# Altium schematic sheet IOb.SchDoc
size A4; SheetNumber: 9; SheetTotal: 9
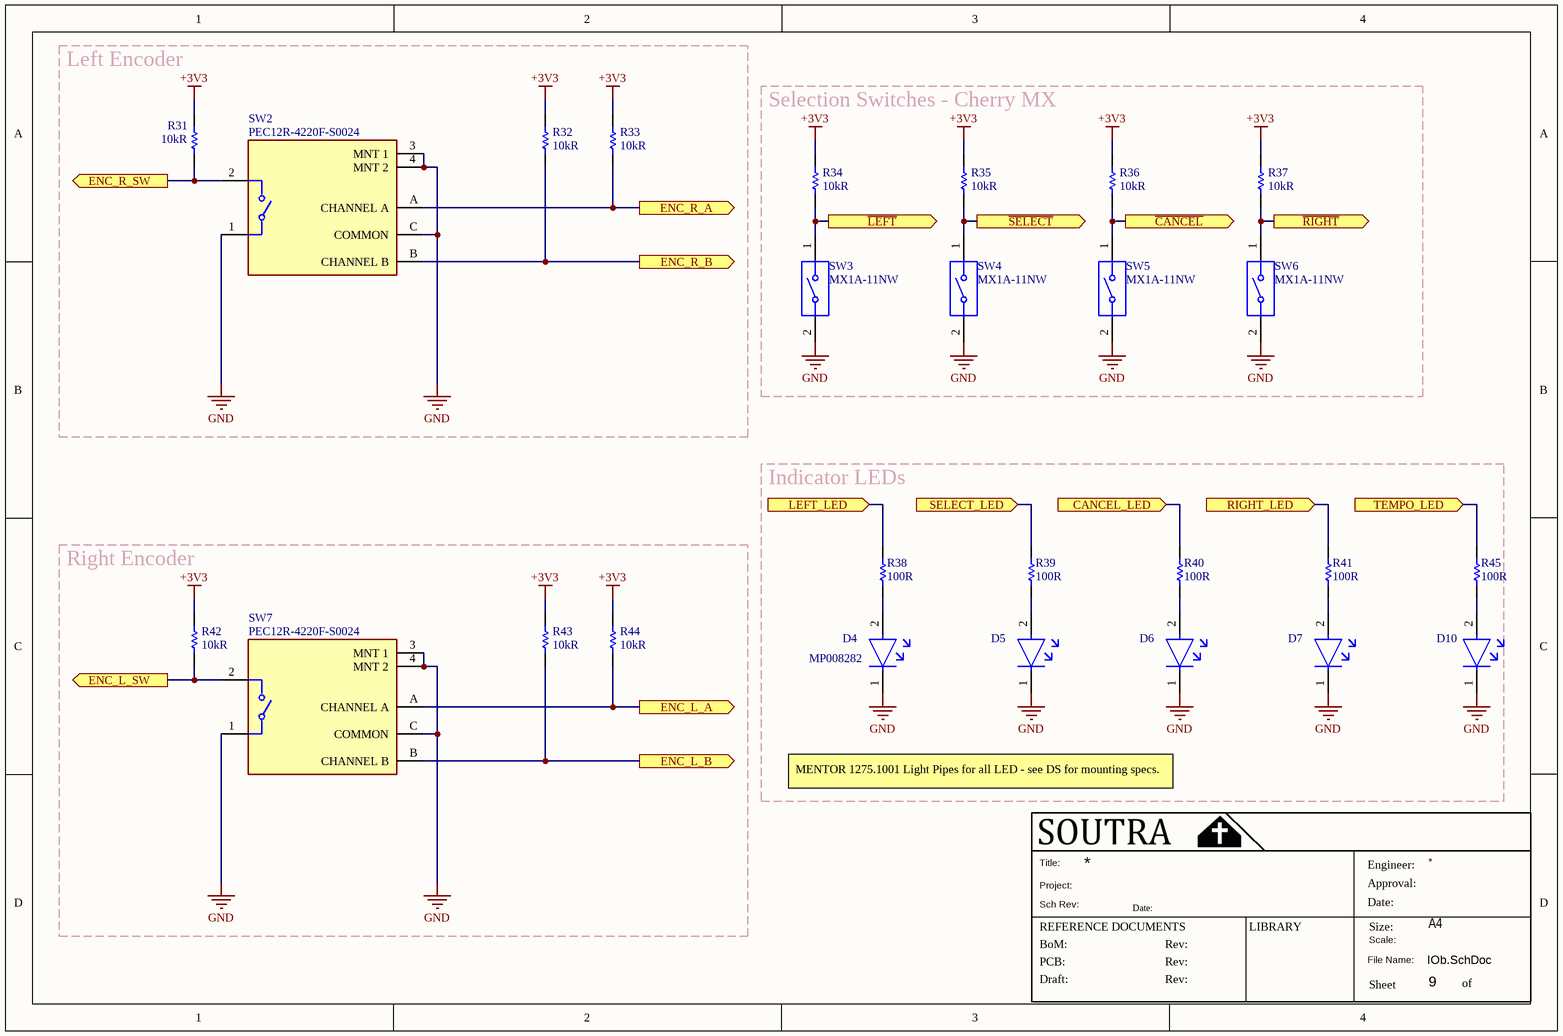
[diagram p0: IOb.SchDoc]

## Parts
D4  MP008282  [DIOC_0603_1706X06L]
D5  MP008282  [DIOC_0603_1706X06L]  (value not drawn)
D6  MP008282  [DIOC_0603_1706X06L]  (value not drawn)
D7  MP008282  [DIOC_0603_1706X06L]  (value not drawn)
D10  MP008282  [DIOC_0603_1706X06L]  (value not drawn)
R31  value 10kR  [RESC_0805_2013X50X30LL20T20]  (hidden comment: RC0805JR-0710KL)
R32  value 10kR  [RESC_0805_2013X50X30LL20T20]  (hidden comment: RC0805JR-0710KL)
R33  value 10kR  [RESC_0805_2013X50X30LL20T20]  (hidden comment: RC0805JR-0710KL)
R34  value 10kR  [RESC_0805_2013X50X30LL20T20]  (hidden comment: RC0805JR-0710KL)
R35  value 10kR  [RESC_0805_2013X50X30LL20T20]  (hidden comment: RC0805JR-0710KL)
R36  value 10kR  [RESC_0805_2013X50X30LL20T20]  (hidden comment: RC0805JR-0710KL)
R37  value 10kR  [RESC_0805_2013X50X30LL20T20]  (hidden comment: RC0805JR-0710KL)
R38  value 100R  [RESC_0805_2013X50X30LL20T20]  (hidden comment: CRCW0805100RFKTA)
R39  value 100R  [RESC_0805_2013X50X30LL20T20]  (hidden comment: CRCW0805100RFKTA)
R40  value 100R  [RESC_0805_2013X50X30LL20T20]  (hidden comment: CRCW0805100RFKTA)
R41  value 100R  [RESC_0805_2013X50X30LL20T20]  (hidden comment: CRCW0805100RFKTA)
R42  value 10kR  [RESC_0805_2013X50X30LL20T20]  (hidden comment: RC0805JR-0710KL)
R43  value 10kR  [RESC_0805_2013X50X30LL20T20]  (hidden comment: RC0805JR-0710KL)
R44  value 10kR  [RESC_0805_2013X50X30LL20T20]  (hidden comment: RC0805JR-0710KL)
R45  value 100R  [RESC_0805_2013X50X30LL20T20]  (hidden comment: CRCW0805100RFKTA)
SW2  PEC12R-4220F-S0024  [BOURNS_PEC12R-4220F-S0024]
SW3  MX1A-11NW  [CHERRY_MX1A-11NW]
SW4  MX1A-11NW  [CHERRY_MX1A-11NW]
SW5  MX1A-11NW  [CHERRY_MX1A-11NW]
SW6  MX1A-11NW  [CHERRY_MX1A-11NW]
SW7  PEC12R-4220F-S0024  [BOURNS_PEC12R-4220F-S0024]

## Blocks framed on the sheet
Left Encoder: R31-R33 SW2
Selection Switches - Cherry MX: R34-R37 SW3-SW6
Indicator LEDs: D4-D7 D10 R38-R41 R45
Right Encoder: R42-R44 SW7

## Ports
CANCEL_LED (in, see Block Diagram[2C], MCU[3B]), ENC_L_A (out, see Block Diagram[2C], MCU[2B]), ENC_L_B (out, see Block Diagram[2C], MCU[2B]), ENC_L_SW (out, see Block Diagram[2C], MCU[2B]), ENC_R_A (out, see Block Diagram[2C], MCU[3B]), ENC_R_B (out, see Block Diagram[2C], MCU[2B]), ENC_R_SW (out, see Block Diagram[2C], MCU[3B]), LEFT_LED (in, see Block Diagram[2C], MCU[2C]), RIGHT_LED (in, see Block Diagram[2C], MCU[2B]), SELECT_LED (in, see Block Diagram[2C], MCU[2C]), TEMPO_LED (in, see Block Diagram[2B], MCU[2C]), ~{CANCEL} (out, see Block Diagram[2C], MCU[3B]), ~{LEFT} (out, see Block Diagram[2B], MCU[3B]), ~{RIGHT} (out, see Block Diagram[2C], MCU[3B]), ~{SELECT} (out, see Block Diagram[2B], MCU[3B])

## Nets
+3V3: R31.2 R32.2 R33.2 R34.2 R35.2 R36.2 R37.2 R42.2 R43.2 R44.2
GND: D4.1(C) D5.1(C) D6.1(C) D7.1(C) D10.1(C) SW2.1 SW2.3(MNT_1) SW2.4(MNT_2) SW2.C(COMMON) SW3.2 SW4.2 SW5.2 SW6.2 SW7.1 SW7.3(MNT_1) SW7.4(MNT_2) SW7.C(COMMON)
~{CANCEL}: R36.1 SW5.1 ; port ~{CANCEL}
~{LEFT}: R34.1 SW3.1 ; port ~{LEFT}
~{RIGHT}: R37.1 SW6.1 ; port ~{RIGHT}
~{SELECT}: R35.1 SW4.1 ; port ~{SELECT}
CANCEL_LED: R40.1 ; port CANCEL_LED
ENC_L_A: R44.1 SW7.A(CHANNEL_A) ; port ENC_L_A
ENC_L_B: R43.1 SW7.B(CHANNEL_B) ; port ENC_L_B
ENC_L_SW: R42.1 SW7.2 ; port ENC_L_SW
ENC_R_A: R33.1 SW2.A(CHANNEL_A) ; port ENC_R_A
ENC_R_B: R32.1 SW2.B(CHANNEL_B) ; port ENC_R_B
ENC_R_SW: R31.1 SW2.2 ; port ENC_R_SW
LEFT_LED: R38.1 ; port LEFT_LED
RIGHT_LED: R41.1 ; port RIGHT_LED
SELECT_LED: R39.1 ; port SELECT_LED
TEMPO_LED: R45.1 ; port TEMPO_LED
NetD4_2: D4.2(A) R38.2
NetD5_2: D5.2(A) R39.2
NetD6_2: D6.2(A) R40.2
NetD7_2: D7.2(A) R41.2
NetD10_2: D10.2(A) R45.2

## Notes on the sheet
- MENTOR 1275.1001 Light Pipes for all LED - see DS for mounting specs.
- Title:
- Project:
- Sch Rev:
- Date:
- Engineer:
- Approval:
- REFERENCE DOCUMENTS
- BoM:
- PCB:
- Draft:
- Rev:
- LIBRARY
- File Name:
- Scale:
- Size:
- Sheet
- A4
- of

## Library data of the parts
D4-D7 D10 = MP008282: Led, Green, 70Mcd, 575Nm, 0603 Rohs Compliant: Yes; Manufacturer: Multicomp; Alternative Part: LG Q396-PS-35; Alternative Part Manufacturer: AMS OSRAM GROUP; Supplier: Farnell; Supplier Part Number: 3796313; Manufacturer Part Number: MP008282; RoHS: No; Category: Uncategorized; Stock: 8324; Pricing: 5=0.0713, 10=0.0611, 100=0.0476; Alternative Part Supplier: Farnell; Alternative Part Supplier Part Number: 2575345
R31-R37 R42-R44 = RC0805JR-0710KL: Fixed Resistor, Metal Glaze/thick Film, 0.125W, 10000ohm, 150V, 5% +/-Tol, 100ppm/Cel, Surface Mount, 0805; Manufacturer: Yageo; Alternative Part: MCMR08X103 JTL; Additional Feature: LASER TRIMMABLE; Power: 125mW; Rated Temperature: 70°C; Temperature Coefficient: 100ppm/°C; Package Height: 0.5mm; Package Length: 2mm; Package Width: 1.25mm; Supplier: Farnell; Supplier Part Number: 9234136; Manufacturer Part Number: RC0805JR-0710KL; RoHS: Yes; Category: Chip SMD Resistors; Stock: 893694; Pricing: 10=0.013, 100=0.007, 500=0.006; Mounting Technology: Surface Mount; Pins: 2; Package Shape: Rectangular; Case/Package: 0805; Terminal Finish: Nickel; Min Operating Temperature: -55°C; Max Operating Temperature: 155°C; Tolerance: 5%; JESD-609 Code: e3; Resistor Type: FIXED RESISTOR; Construction: Chip; Package Style: SMTMeter; Packaging: Tape and Reel; Technology: METAL GLAZE/THICK FILM; Termination: Wraparound; Working Voltage: 150V; Reach SVHC Compliant: Yes; RoHS Compliant: Yes; ComponentLink1URL: https://datasheet.ciiva.com:443/pdfs/VipMasterIC/IC/YAGO/YAGO-S-A0008145938/YAGO-S-A0008145938-1.pdf?src-supplier=IHS+Markit; ComponentLink1Description: https://datasheet.ciiva.com:443/pdfs/VipMasterIC/IC/YAGO/YAGO-S-A0008145938/YAGO-S-A0008145938-1.pdf?src-supplier=IHS+Markit; ComponentLink2URL: https://datasheet.ciiva.com/7983/444164-7983765.pdf?src-supplier=Element14; ComponentLink2Description: https://datasheet.ciiva.com/7983/444164-7983765.pdf?src-supplier=Element14; ComponentLink3URL: https://datasheet.ciiva.com/7941/444164-7941870.pdf?src-supplier=Element14; ComponentLink3Description: https://datasheet.ciiva.com/7941/444164-7941870.pdf?src-supplier=Element14; ComponentLink4URL: https://datasheet.ciiva.com/7941/444164-7941871.pdf?src-supplier=Element14; ComponentLink4Description: https://datasheet.ciiva.com/7941/444164-7941871.pdf?src-supplier=Element14; Supplier 1: Digikey; Supplier Part Number 1: 311-10KARCT-ND; Pricing 1: 1=0.08, 10=0.018, 50=0.011, 100=0.009; Alternative Part Supplier: Farnell; Alternative Part Supplier Part Number: 2073612
R38-R41 R45 = CRCW0805100RFKTA: Fixed Resistor, Metal Glaze/thick Film, 0.125W, 100ohm, 150V, 1% +/-Tol, 100ppm/Cel, Surface Mount, 0805; Manufacturer: Vishay Dale; Alternative Part: CRCW0805100RFKEA; Alternative Part Manufacturer: VISHAY; Power: 125mW; Rated Temperature: 70°C; Temperature Coefficient: 100ppm/°C; Package Height: 0.45mm; Package Length: 2mm; Package Width: 1.25mm; Reference Standard: AEC-Q200; Supplier: Farnell; Supplier Part Number: 1652906; Manufacturer Part Number: CRCW0805100RFKTA; RoHS: No; Category: Chip SMD Resistors; Stock: 46002; Pricing: 10=0.06, 100=0.026; Mounting Technology: Surface Mount; Pins: 2; Package Shape: Rectangular; Case/Package: 0805; Terminal Finish: Nickel; Min Operating Temperature: -55°C; Max Operating Temperature: 155°C; Tolerance: 1%; JESD-609 Code: e0; Resistor Type: FIXED RESISTOR; Packaging: Tape and Reel; Technology: METAL GLAZE/THICK FILM; Termination: Wraparound; Working Voltage: 150V; Construction: Chip; Package Style: SMTMeter; RoHS Compliant: No; Reach SVHC Compliant: No; ComponentLink1URL: https://datasheet.ciiva.com:443/pdfs/VipMasterIC/IC/VISH/VISH-S-A0002183699/VISH-S-A0002183699-1.pdf?src-supplier=IHS+Markit; ComponentLink1Description: https://datasheet.ciiva.com:443/pdfs/VipMasterIC/IC/VISH/VISH-S-A0002183699/VISH-S-A0002183699-1.pdf?src-supplier=IHS+Markit; ComponentLink2URL: https://datasheet.ciiva.com/48525/dcrcw-48525548.pdf?src-supplier=Avnet; ComponentLink2Description: https://datasheet.ciiva.com/48525/dcrcw-48525548.pdf?src-supplier=Avnet; ComponentLink3URL: https://datasheet.ciiva.com/3258/dcrcw-3258014.pdf?src-supplier=Avnet; ComponentLink3Description: https://datasheet.ciiva.com/3258/dcrcw-3258014.pdf?src-supplier=Avnet; ComponentLink4URL: https://datasheet.ciiva.com/2567/dcrcw-2567005.pdf?src-supplier=Digi-Key; ComponentLink4Description: https://datasheet.ciiva.com/2567/dcrcw-2567005.pdf?src-supplier=Digi-Key; ComponentLink5URL: https://datasheet.ciiva.com/22673/1533075-22673125.pdf?src-supplier=Element14; ComponentLink5Description: https://datasheet.ciiva.com/22673/1533075-22673125.pdf?src-supplier=Element14; ComponentLink6URL: https://datasheet.ciiva.com/16498/dcrcw-16498296.pdf?src-supplier=Future+Electronics; ComponentLink6Description: https://datasheet.ciiva.com/16498/dcrcw-16498296.pdf?src-supplier=Future+Electronics; Supplier 1: Mouser; Supplier Part Number 1: 71-CRCW0805-100; Pricing 1: 1=0.12, 10=0.042, 100=0.027; Alternative Part Supplier: Farnell; Alternative Part Supplier Part Number: 1469862
SW2 SW7 = PEC12R-4220F-S0024: Rotary Position Encoder, Single, 2 Channels; Manufacturer: Bourns; Channels: 1; Supplier: Farnell; Supplier Part Number: 2663532; Manufacturer Part Number: PEC12R-4220F-S0024; RoHS: Yes; Category: Encoders; Stock: 3003; Pricing: 1=1.7, 5=1.49, 10=1.26, 20=1.16, 40=1.06, 75=0.97; Min Operating Temperature: -30°C; Max Operating Temperature: 70°C; Optoelectronic Device Type: ROTARY POSITION ENCODER; RoHS Compliant: Yes; Reach SVHC Compliant: Yes; ComponentLink1URL: https://datasheet.ciiva.com:443/pdfs/VipMasterIC/IC/BOUR/BOUR-S-A0008996893/BOUR-S-A0008996893-1.pdf?src-supplier=IHS+Markit; ComponentLink1Description: https://datasheet.ciiva.com:443/pdfs/VipMasterIC/IC/BOUR/BOUR-S-A0008996893/BOUR-S-A0008996893-1.pdf?src-supplier=IHS+Markit; ComponentLink2URL: https://datasheet.ciiva.com/29349/pec12r-29349497.pdf?src-supplier=Digikey; ComponentLink2Description: https://datasheet.ciiva.com/29349/pec12r-29349497.pdf?src-supplier=Digikey; Supplier 1: Digikey; Supplier Part Number 1: PEC12R-4220F-S0024-ND; Pricing 1: 1=1.28, 5=1.21, 10=1.14, 25=1.04, 75=0.97; Stock 1: 677
SW3-SW6 = MX1A-11NW: Keypad Switch, 1 Switches, SPST, Momentary, 0.01A, 12VDC, 0.78N, Solder Terminal, Through Hole-straight; Manufacturer: Cherry; Manufacturer Series: MX; Circuit Configuration: 1X1; Contact Bounce Time-Max: 5ms; Contact Current(DC)-Max: 10mA; Contact DC Max Rating R Load: .01A@12VDC; Contact Voltage(DC)-Max: 12V; Electrical Life: 50000000Cycles; Number of Switches: 1; Body Breadth: 15.6inch; Body Height: 11.6mm; Body Length or Diameter: 15.6mm; Supplier: Mech Boards; Supplier Part Number: ACHERSW0315325; Manufacturer Part Number: MX1A-11NW; RoHS: Yes; Category: Pushbutton Switches; Pricing: 10=5; Mounting Technology: Through Hole; Min Operating Temperature: -10°C; Max Operating Temperature: 70°C; Operating Force-Max: 0.78N; Switch Action: MOMENTARY; Switch Function: SPST; Switch Type: Keypad; Termination: Solder; Reach SVHC Compliant: Yes; RoHS Compliant: Yes; ComponentLink1URL: https://datasheet.ciiva.com:443/pdfs/VipMasterIC/IC/CHCP/CHCP-S-A0000003074/CHCP-S-A0000003074-1.pdf?src-supplier=IHS+Markit; ComponentLink1Description: https://datasheet.ciiva.com:443/pdfs/VipMasterIC/IC/CHCP/CHCP-S-A0000003074/CHCP-S-A0000003074-1.pdf?src-supplier=IHS+Markit; ComponentLink2URL: https://datasheet.ciiva.com/19475/513412-19475559.pdf?src-supplier=Jameco; ComponentLink2Description: https://datasheet.ciiva.com/19475/513412-19475559.pdf?src-supplier=Jameco; ComponentLink3URL: https://datasheet.ciiva.com/29188/706333-da-01-de-tastenmodul-mx1a-11nw-0-01a-12v-29188128.pdf?src-supplier=Conrad; ComponentLink3Description: https://datasheet.ciiva.com/29188/706333-da-01-de-tastenmodul-mx1a-11nw-0-01a-12v-29188128.pdf?src-supplier=Conrad; ComponentLink4URL: https://datasheet.ciiva.com/2869/mxseries-2869564.pdf?src-supplier=Digikey; ComponentLink4Description: https://datasheet.ciiva.com/2869/mxseries-2869564.pdf?src-supplier=Digikey; ComponentLink5URL: https://datasheet.ciiva.com/22638/1825426-22638522.pdf?src-supplier=Element14; ComponentLink5Description: https://datasheet.ciiva.com/22638/1825426-22638522.pdf?src-supplier=Element14; ComponentLink6URL: https://datasheet.ciiva.com/1701/1825426-1701391.pdf?src-supplier=Newark; ComponentLink6Description: https://datasheet.ciiva.com/1701/1825426-1701391.pdf?src-supplier=Newark; ComponentLink7URL: https://datasheet.ciiva.com/30215/cherry-mx-series-key-switch-30215301.pdf?src-supplier=Onlinecomponents.com; ComponentLink7Description: https://datasheet.ciiva.com/30215/cherry-mx-series-key-switch-30215301.pdf?src-supplier=Onlinecomponents.com; ComponentLink8URL: https://datasheet.ciiva.com/14536/70207618-14536679.pdf?src-supplier=Allied+Electronics; ComponentLink8Description: https://datasheet.ciiva.com/14536/70207618-14536679.pdf?src-supplier=Allied+Electronics